# Altium schematic sheet Connectors.SchDoc
size A4; SheetNumber: 1; SheetTotal: 2
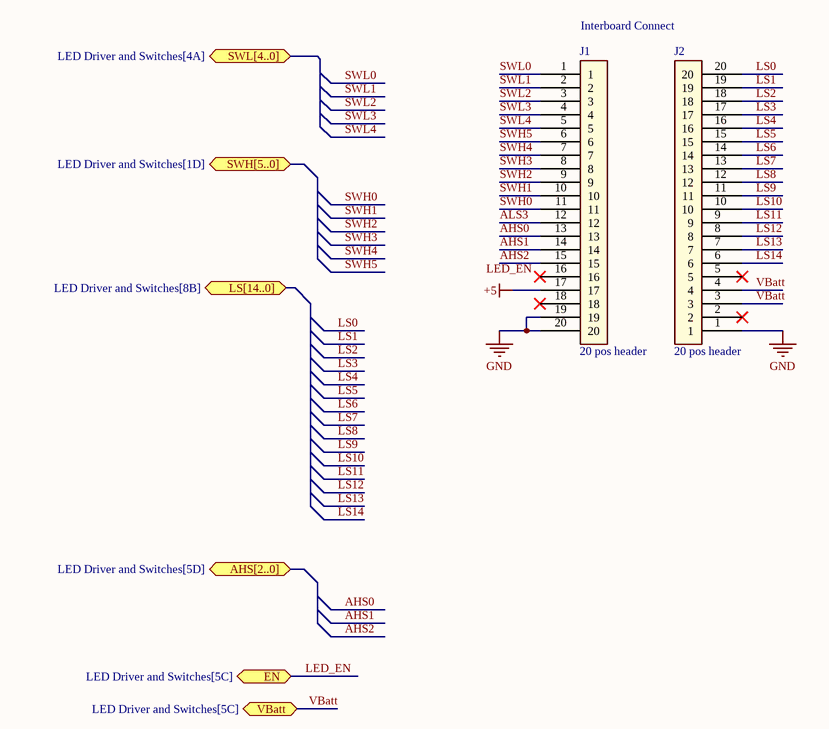
[diagram p0: Connectors.SchDoc]

## Parts
J1  20 pos header  [20 pos header]
J2  20 pos header  [20 pos header]

## Ports
AHS[2..0] (bidir, see LED Driver and Switches[5D]), EN (bidir, see LED Driver and Switches[5C]), LS[14..0] (bidir, see LED Driver and Switches[8B]), SWH[5..0] (bidir, see LED Driver and Switches[1D]), SWL[4..0] (bidir, see LED Driver and Switches[4A]), VBatt (bidir, see LED Driver and Switches[5C])

## Nets
+5: J1.17
GND: J1.19 J1.20 J2.1
AHS0: J1.13
AHS1: J1.14
AHS2: J1.15
ALS3: J1.12
LED_EN: port EN
LS0: J2.20
LS1: J2.19
LS2: J2.18
LS3: J2.17
LS4: J2.16
LS5: J2.15
LS6: J2.14
LS7: J2.13
LS8: J2.12
LS9: J2.11
LS10: J2.10
LS11: J2.9
LS12: J2.8
LS13: J2.7
LS14: J2.6
SWH0: J1.11
SWH1: J1.10
SWH2: J1.9
SWH3: J1.8
SWH4: J1.7
SWH5: J1.6
SWL0: J1.1
SWL1: J1.2
SWL2: J1.3
SWL3: J1.4
SWL4: J1.5
VBatt: J2.3 J2.4 ; port VBatt

Not connected (* = marked no-connect by the designer): J1 16* 18*; J2 2* 5*

## Notes on the sheet
- Interboard Connect
- Labels drawn without touching a wire or pin: LED_EN